# Altium schematic sheet OC_PROT.SchDoc
size C; SheetNumber: 3; SheetTotal: 10
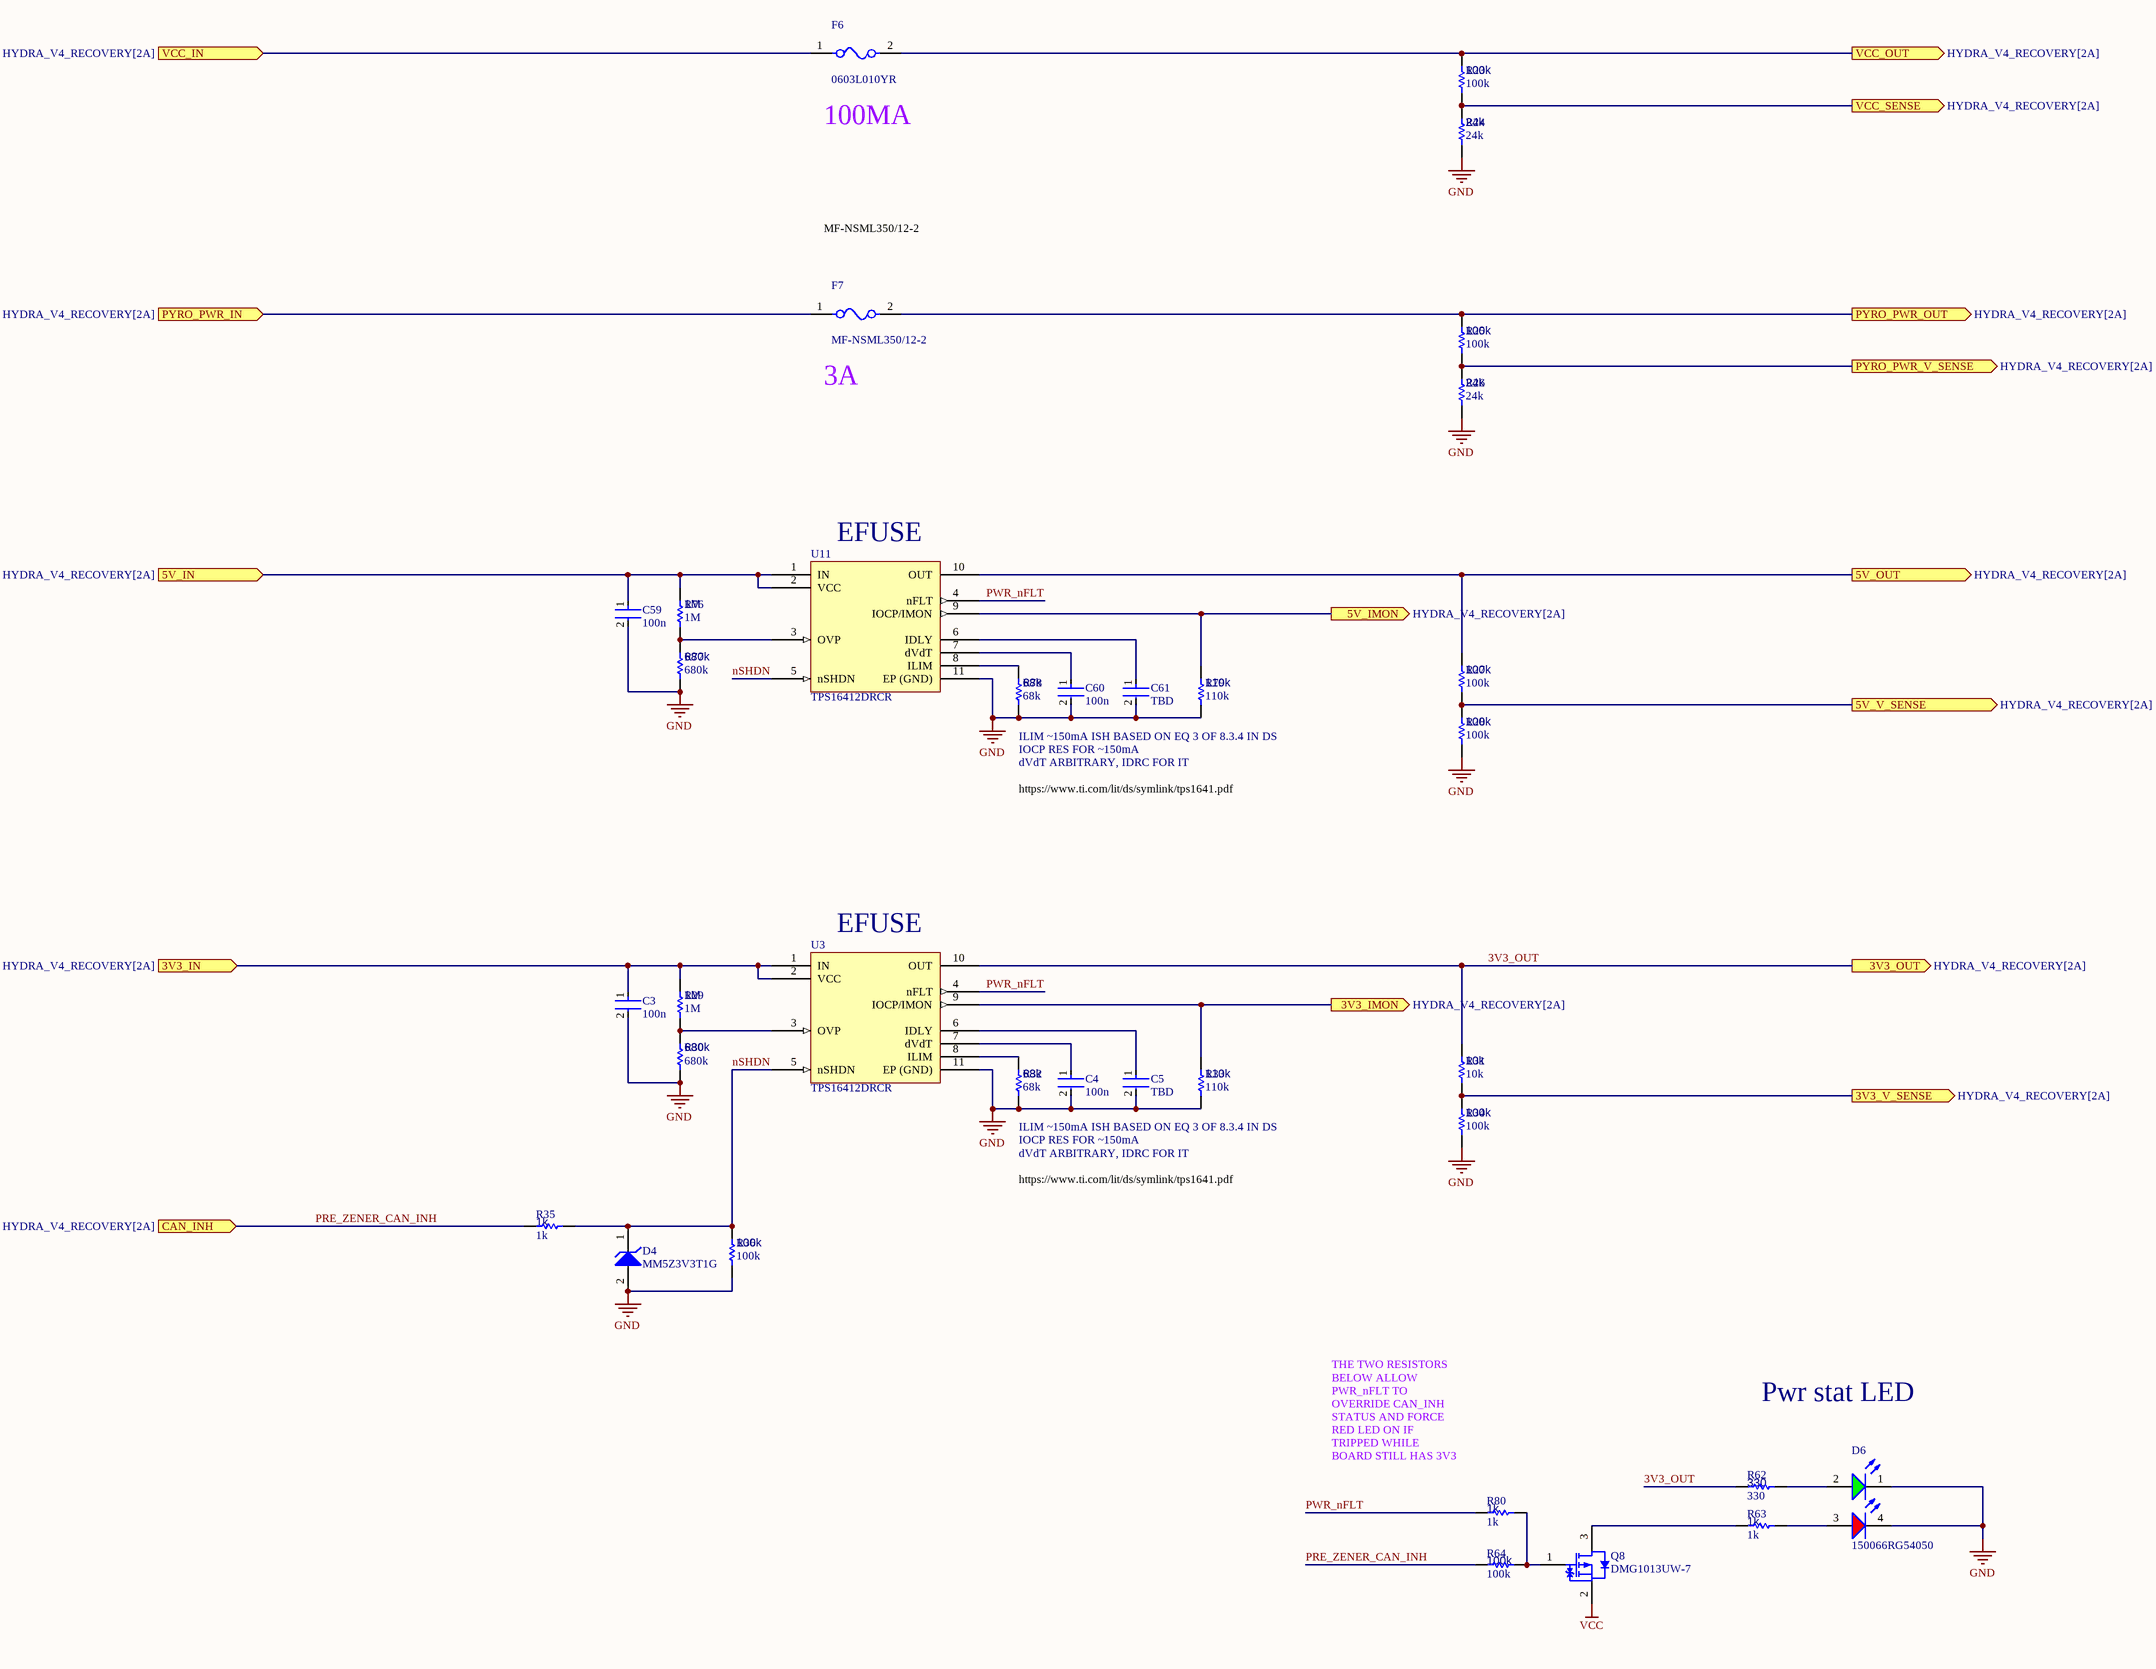
[diagram p0: OC_PROT.SchDoc]

## Parts
C3  100n  [FP-0402-L_1_0_0_05-W_0_5-IPC_A]
C4  100n  [FP-0402-L_1_0_0_05-W_0_5-IPC_A]
C5  TBD  [FP-0402-L_1_0_0_05-W_0_5-IPC_A]
C59  100n  [FP-0402-L_1_0_0_05-W_0_5-IPC_A]
C60  100n  [FP-0402-L_1_0_0_05-W_0_5-IPC_A]
C61  TBD  [FP-0402-L_1_0_0_05-W_0_5-IPC_A]
D4  MM5Z3V3T1G  [ONSC-SOD-523-2-502-01_V]
D6  150066RG54050  [WL-SBCD_0606]
F6  0603L010YR  [FP-0603L-MFG]
F7  MF-NSML350/12-2  [FP-MF-NSMF012-2-MFG]
Q8  DMG1013UW-7  [DIOD-SOT323-3_V]
R23  100k  [R0603B]
R24  24k  [R0603B]
R25  100k  [R0603B]
R26  24k  [R0603B]
R27  100k  [R0603B]
R28  100k  [R0603B]
R29  1M  [R0603B]
R30  680k  [R0603B]
R31  10k  [R0603B]
R32  68k  [R0603B]
R33  110k  [R0603B]
R34  100k  [R0603B]
R35  1k  [R0603B]
R36  100k  [R0603B]
R62  330  [R0603B]
R63  1k  [R0603B]
R64  100k  [R0603B]
R76  1M  [R0603B]
R77  680k  [R0603B]
R78  68k  [R0603B]
R79  110k  [R0603B]
R80  1k  [R0603B]
U3  TPS16412DRCR  [PSON50P300X100_HS-11N]
U11  TPS16412DRCR  [PSON50P300X100_HS-11N]

## Ports
3V3_IMON (out, see HYDRA_V4_RECOVERY[2A]), 3V3_IN (in, see HYDRA_V4_RECOVERY[2A]), 3V3_OUT (out, see HYDRA_V4_RECOVERY[2A]), 3V3_V_SENSE (out, see HYDRA_V4_RECOVERY[2A]), 5V_IMON (out, see HYDRA_V4_RECOVERY[2A]), 5V_IN (in, see HYDRA_V4_RECOVERY[2A]), 5V_OUT (out, see HYDRA_V4_RECOVERY[2A]), 5V_V_SENSE (out, see HYDRA_V4_RECOVERY[2A]), CAN_INH (in, see HYDRA_V4_RECOVERY[2A]), PYRO_PWR_IN (in, see HYDRA_V4_RECOVERY[2A]), PYRO_PWR_OUT (out, see HYDRA_V4_RECOVERY[2A]), PYRO_PWR_V_SENSE (out, see HYDRA_V4_RECOVERY[2A]), VCC_IN (in, see HYDRA_V4_RECOVERY[2A]), VCC_OUT (out, see HYDRA_V4_RECOVERY[2A]), VCC_SENSE (out, see HYDRA_V4_RECOVERY[2A])

## Nets
GND: C3.2 C4.2 C5.2 C59.2 C60.2 C61.2 D4.2(A) D6.1(K) D6.4(K) R24.1 R26.1 R28.1 R30.2 R32.2 R33.2 R34.1 R36.1 R77.2 R78.2 R79.2 U3.11(EP_(GND)) U11.11(EP_(GND))
VCC: Q8.2(S)
3V3_IMON: R33.1 U3.9(IOCP/IMON) ; port 3V3_IMON
3V3_IN: C3.1 R29.1 U3.1(IN) U3.2(VCC) ; port 3V3_IN
3V3_OUT: R31.2 R62.2 U3.10(OUT) ; port 3V3_OUT
3V3_V_SENSE: R31.1 R34.2 ; port 3V3_V_SENSE
5V_IMON: R79.1 U11.9(IOCP/IMON) ; port 5V_IMON
5V_IN: C59.1 R76.1 U11.1(IN) U11.2(VCC) ; port 5V_IN
5V_OUT: R27.2 U11.10(OUT) ; port 5V_OUT
5V_V_SENSE: R27.1 R28.2 ; port 5V_V_SENSE
nSHDN: D4.1(K) R35.1 R36.2 U3.5(nSHDN) U11.5(nSHDN)
PRE_ZENER_CAN_INH: R35.2 R64.2 ; port CAN_INH
PWR_nFLT: R80.2 U3.4(nFLT) U11.4(nFLT)
PYRO_PWR_IN: F7.1 ; port PYRO_PWR_IN
PYRO_PWR_OUT: F7.2 R25.2 ; port PYRO_PWR_OUT
PYRO_PWR_V_SENSE: R25.1 R26.2 ; port PYRO_PWR_V_SENSE
VCC_IN: F6.1 ; port VCC_IN
VCC_OUT: F6.2 R23.2 ; port VCC_OUT
VCC_SENSE: R23.1 R24.2 ; port VCC_SENSE
NetC4_1: C4.1 U3.7(dVdT)
NetC5_1: C5.1 U3.6(IDLY)
NetC60_1: C60.1 U11.7(dVdT)
NetC61_1: C61.1 U11.6(IDLY)
NetD6_2: D6.2(A) R62.1
NetD6_3: D6.3(A) R63.1
NetQ8_1: Q8.1(G) R64.1 R80.1
NetQ8_3: Q8.3(D) R63.2
NetR29_2: R29.2 R30.1 U3.3(OVP)
NetR32_1: R32.1 U3.8(ILIM)
NetR76_2: R76.2 R77.1 U11.3(OVP)
NetR78_1: R78.1 U11.8(ILIM)

## Notes on the sheet
- (near F6) 100MA
- MF-NSML350/12-2
- (near F7) 3A
- (near U11) EFUSE
- ILIM ~150mA ISH BASED ON EQ 3 OF 8.3.4 IN DS
- dVdT ARBITRARY, IDRC FOR IT
- IOCP RES FOR ~150mA
- https://www.ti.com/lit/ds/symlink/tps1641.pdf
- (near U3) EFUSE
- Pwr stat LED
- (near R80) THE TWO RESISTORS BELOW ALLOW PWR_nFLT TO OVERRIDE CAN_INH STATUS AND FORCE RED LED ON IF TRIPPED WHILE BOARD STILL HAS 3V3

## Library data of the parts
C3-C5 C59-C61 = CMP-001-00058-1: LARGE PADS, 0402 CAP, CHANGE COMMENT TO MATCH REAL P/N; Capacitor Type: Ceramic; Min Operating Temperature: -55°C; Mounting Technology: Surface Mount; Pins: 2; Case/Package: 0402; RoHS Compliant: Yes; Max Operating Temperature: 85°C
  C3 C4 C59 C60: Value: 100n
  C5 C61: Value: TBD
D4 = CMP-1060-00750-1: Zener Voltage Regulator, 500 mW, 2-Pin SOD-523, Pb-Free, Tape and Reel; Manufacturer: On Semiconductor; P Max (W): 0.5; VZ Typ (V): 3.3; RoHS: Pb-Free; ComponentLink2Description: Datasheet; PackageReference: SOD-523-2-502-01; DatasheetVersion: Rev. 10; ComponentLink1Description: Manufacturer URL; PackageVersion: Rev. E, 09/2010; ComponentLink3URL: http://www.onsemi.com/pub_link/Collateral/502-01.PDF; ComponentLink2URL: http://www.onsemi.cn/pub_link/Collateral/MM5Z2V4T1-D.PDF; Mounting Technology: Surface Mount; PartNumber: MM5Z3V3T1G; Packing: Tape and Reel; PackageDescription: 2-Pin SOD, Body 1.2 x 0.8 mm; ComponentLink1URL: http://www.onsemi.com/; ComponentLink3Description: Package Specification
D6 = CMP-004-00040-2: Led, Red/Grn, 180Mcd/230Mcd, 624Nm/525Nm Rohs Compliant: Yes; Source: rgled.SchLib; Component Type: Standard; Design Item ID: CMP-004-00034-2; Pins: 4
F6 = CMP-08606-000025-1: PTC RESET FUSE 15V 100MA 0603; Manufacturer: Littelfuse Inc; Value: 0.9-6Ω; Trip Time: 1s; Current Rating: 40A; Trip Current: 0.3A; Hold Current: 0.1A; Octopart: https://octopart.com/0603l010yr-littelfuse-8316166; ComponentLink2URL: https://www.littelfuse.com/~/media/electronics/datasheets/resettable_ptcs/littelfuse_ptc_0603l_datasheet.pdf.pdf; Package: 0603L; Category: Fuse; Mouser Description: Resettable Fuses - PPTC PTC 15V 0603 .100A POLY SURF MOUNT; Automotive: No; Resistance: 0.9-6Ω; Device Class L3: unset; Digikey Description: PTC RESET FUSE 15V 100MA 0603; Lead Free: Yes; Temperature: -40°C to +85°C; Ambient Temperature Range High: +85°C; ComponentLink2Description: Datasheet; RoHS: TRUE; Height: 0.75mm; Temperature Range Low: -40°C; Manufacturer Part Number: 0603L010YR; Device Class L2: PTC Resettable Fuses; Device Class L1: Circuit Protection; Temperature Range High: +85°C; Ambient Temperature Range Low: -40°C; Voltage Rating: 15V
F7 = CMP-07400-000025-1: Manufacturer Part Number: MF-NSMF012-2; Manufacturer: Bourns Inc.; Voltage Rating: 30V; Hold Current: 0.12A; Trip Time: 0.2s; Trip Current: 0.29A; Automotive Grade: Grade 3; Resistance: 1.35-8.5Ω; Current Rating: 10A; Value: 1.35-8.5Ω; Category: Fuse; Device Class L2: PTC Resettable Fuses; ComponentLink2URL: https://www.bourns.com/docs/Product-Datasheets/mfnsmf.pdf; Package: MF-NSMF012-2; Automotive: Yes; Temperature Range Low: -40°C; Lead Free: Yes; Digikey Description: PTC RESET FUSE 30V 120MA 1206; Ambient Temperature Range Low: -40°C; Ambient Temperature Range High: +85°C; RoHS: TRUE; Device Class L3: unset; Device Class L1: Circuit Protection; Mouser Description: Resettable Fuses - PPTC 0.12A 30V 1.35ohm; Octopart: https://octopart.com/mf-nsmf012-2-bourns-24569; Temperature Range High: +85°C; ComponentLink2Description: Datasheet; Height: 1.1mm; Temperature: -40°C to +85°C
Q8 = CMP-2000-06170-1: P-Channel Enhancement Mode MOSFET, 310 mW, 20 V, -55 to 150 degC, 3-Pin SOT-323, RoHS, Tape and Reel; Manufacturer: Diodes Inc; Qg Gate Charge: 0.622nC; Drain-Source On Resistance-Max: 750mO; Rated Power Dissipation: 310mW; Drain-to-Source Voltage [Vdss]: 20V; Package Reference: SOT323; Datasheet Version: Rev. 3-2, 09/2013; Package Description: 3-Pin Small Outline Transistor, Body 2 x 1.25 mm, Pitch 0.65 mm; Mounting Technology: SurfaceMount; Manufacturer URL: http://www.diodes.com/; Datasheet URL: http://www.diodes.com/_files/datasheets/ds31861.pdf; Channel Type: P-Channel
R23-R36 R62-R64 R76-R80 = CMP-009-00002-14: Resistor
  R23 R25 R27 R28 R34 R36 R64: Value: 100k
  R24 R26: Value: 24k
  R29 R76: Value: 1M
  R30 R77: Value: 680k
  R31: Value: 10k
  R32 R78: Value: 68k
  R33 R79: Value: 110k
  R35 R63 R80: Value: 1k
  R62: Value: 330
U3 U11 = CMP-019-00048-3: 2.7-V to 40-V 152-mΩ 1.8-A eFuse with output power limiting 10-VSON -40 to 125